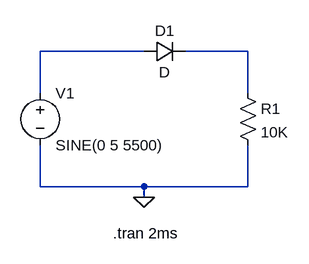
[diagram p0: schematic Lab - 02.asc]
Lab - 02.asc, the LTspice schematic file:
Version 4
SHEET 1 880 680
WIRE 320 192 160 192
WIRE 480 192 384 192
WIRE 160 256 160 192
WIRE 480 256 480 192
WIRE 160 400 160 336
WIRE 320 400 160 400
WIRE 480 400 480 336
WIRE 480 400 320 400
WIRE 320 416 320 400
FLAG 320 416 0
SYMBOL voltage 160 240 R0
SYMATTR InstName V1
SYMATTR Value SINE(0 5 5500)
SYMBOL diode 320 208 R270
WINDOW 0 32 32 VTop 2
WINDOW 3 0 32 VBottom 2
SYMATTR InstName D1
SYMBOL res 464 240 R0
SYMATTR InstName R1
SYMATTR Value 10K
TEXT 272 472 Left 2 !.tran 2ms

The netlist it stands for:
* Lab - 02.asc
V1 N001 0 SINE(0 5 5500)
D1 N001 N002 D
R1 N002 0 10K
.model D D
.lib standard.dio
.tran 2ms
.backanno
.end